# EasyEDA Pro project Armor_ProProject.epro, schematic Schematic1
Create Date: 2023-03-07; Page Name: P1; Project Name: LED; Schematic Name: Schematic1; Update Date: 2023-03-07; Company: 嘉立创EDA; Page Size: A4; Version: V1.0
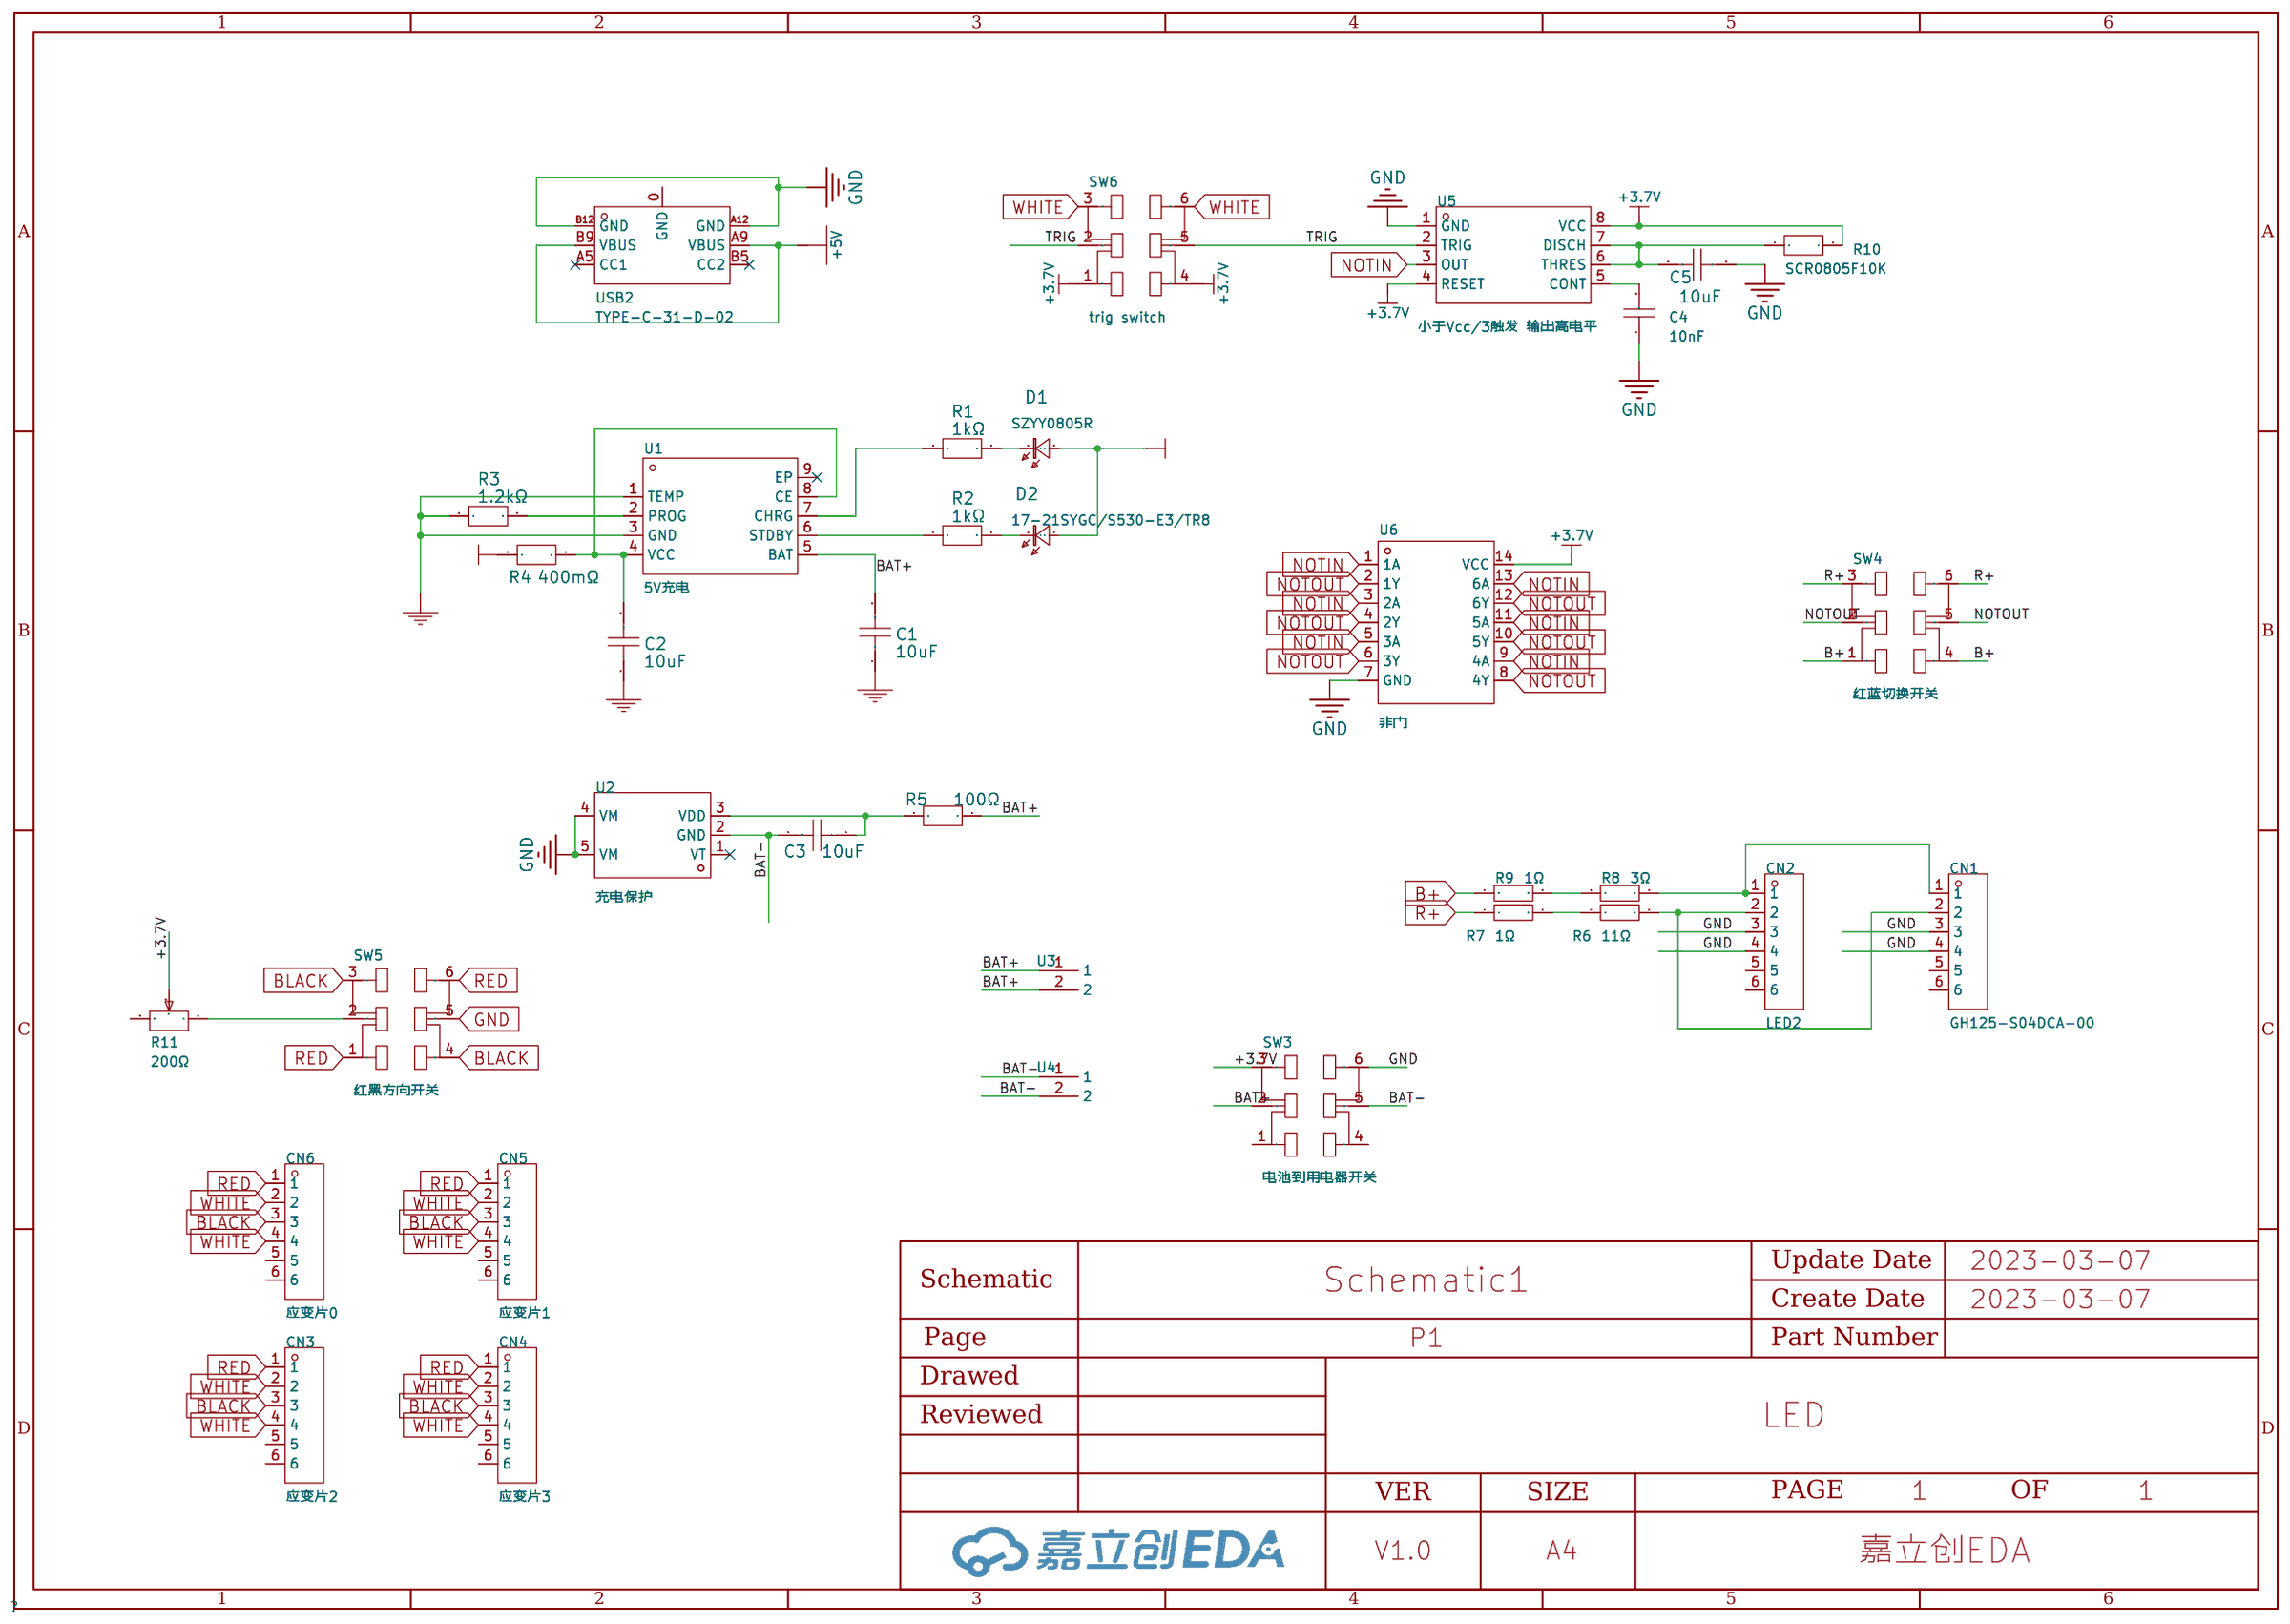
[diagram p8: schematic sheet]

## Parts
C1  10uF  [C0805]
C2  10uF  [C0805]
C3  10uF  [C0805]
C4  10nF  [C0805]
C5  10uF  [C0805]
CN1  GH125-S04DCA-00  [CONN-SMD_4P-P1.27_GH125-S04DCA-00]
CN2  LED2  [CONN-SMD_4P-P1.27_GH125-S04DCA-00]
CN3  应变片2  [CONN-SMD_4P-P1.27_GH125-S04DCA-00]
CN4  应变片3  [CONN-SMD_4P-P1.27_GH125-S04DCA-00]
CN5  应变片1  [CONN-SMD_4P-P1.27_GH125-S04DCA-00]
CN6  应变片0  [CONN-SMD_4P-P1.27_GH125-S04DCA-00]
D1  SZYY0805R  [LED0805-R-RD]
D2  17-21SYGC/S530-E3/TR8  [LED0805-RD]
R1  1kΩ  [R0805]
R2  1kΩ  [R0805]
R3  1.2kΩ  [R0805]
R4  400mΩ  [R0805]
R5  100Ω  [R1206]
R6  11Ω  [R1206]
R7  1Ω  [R1206]
R8  3Ω  [R1206]
R9  1Ω  [R1206]
R10  SCR0805F10K  [R0805]
R11  200Ω  [RES-ADJ-TH_3296W]
SW3  电池到用电器开关  [SW-TH_MSS22D18GX]
SW4  红蓝切换开关  [SW-TH_MSS22D18GX]
SW5  红黑方向开关  [SW-TH_MSS22D18GX]
SW6  trig switch  [SW-TH_MSS22D18GX]
U1  5V充电  [ESOP-8_L4.9-W3.9-P1.27-LS6.0-BL-EP]
U2  充电保护  [SOT-23-5_L3.0-W1.7-P0.95-LS2.8-BR]
U3  -  [2p]
U4  -  [2p]
U5  小于Vcc/3触发 输出高电平  [SOP-8_L5.0-W4.0-P1.27-LS6.0-BL]
U6  非门  [SOIC-14_L8.7-W3.9-P1.27-LS6.0-BL]
USB2  TYPE-C-31-D-02  [USB-C-SMD_TYPE-C-31-D-02]

## Library data of the parts
C1-C3 C5 = CL21A106KBYQNNE: 容值:10uF;精度:±10%;额定电压:50V;材质(温度系数):X5R;; LCSC Part Name: 10uF ±10% 50V; Supplier Part: C2932476; Manufacturer: SAMSUNG(三星); Supplier Footprint: 0805; JLCPCB Part Class: Extended Part; Datasheet: https://atta.szlcsc.com/upload/public/pdf/source/20211217/EA547804C3DC63CB0E92325AB8B6CF61.pdf; Supplier: LCSC; Tolerance: ±10%; Voltage Rated: 50V; Temperature Coefficient: X5R
C4 = CL21B103KBANNNC: 容值:10nF;精度:±10%;额定电压:50V;材质(温度系数):X7R;; LCSC Part Name: 10nF ±10% 50V; Supplier Part: C1710; Manufacturer: SAMSUNG(三星); Supplier Footprint: 0805; JLCPCB Part Class: Basic Part; Datasheet: https://atta.szlcsc.com/upload/public/pdf/source/20160103/1457707693082.pdf; Supplier: LCSC; Tolerance: ±10%; Voltage Rated: 50V; Temperature Coefficient: X7R
CN1-CN6 = GH125-S04DCA-00: 参考系列:-;间距:1.25mm;插针结构:1x4P;排数:1;每排PIN数:4;行距:-;公母:公型插针;安装方式:卧贴;额定电流:1A;工作温度范围:-25℃~+85℃;; LCSC Part Name: GH1.25卧式贴片 带扣; Supplier Part: C2886767; Manufacturer: JS(钜硕电子); Supplier Footprint: SMD,P=1.25mm; JLCPCB Part Class: Extended Part; Datasheet: https://atta.szlcsc.com/upload/public/pdf/source/20210818/CD11791E5ED3EDF45A7009E9C8A2BD4C.pdf; Supplier: LCSC; Pitch: 1.25mm; Pins Structure: 1x4P; Number of Rows: 1; Number of PINs Per Row: 4; Gender: 公型插针; Mounting Style: 卧贴; Current Rating (Max): 1A; Operating Temperature Range: -25℃~+85℃
D1 = SZYY0805R: 发光颜色:红灯;二极管配置:-;透镜颜色:无色透明;主波长:615nm~630nm;峰值波长:645nm;色温:-;测试电流:10mA;功率:40mW;发光角度:120°;安装方式:-;工作温度:-40℃~+85℃;; LCSC Part Name: 红灯 615nm~630nm; Supplier Part: C434431; Manufacturer: yongyu(永裕光电); Supplier Footprint: 0805; JLCPCB Part Class: Extended Part; Datasheet: https://atta.szlcsc.com/upload/public/pdf/source/20191204/C434431_431C171B758FE4C37FA40B1B295AA7AB.pdf; Supplier: LCSC; Emitted Color: 红灯; Lens Color: 无色透明; Dominant Wavelength: 615nm~630nm; Peak Wavelength: 645nm; Forward Current: 10mA; Power Dissipation: 40mW; Viewing Angle: 120°; Operating Temperature: -40℃~+85℃
D2 = 17-21SYGC/S530-E3/TR8: 发光颜色:普绿/黄绿;; LCSC Part Name: 普绿/黄绿; Supplier Part: C142303; Manufacturer: EVERLIGHT(亿光); Supplier Footprint: 0805; JLCPCB Part Class: Extended Part; Datasheet: https://atta.szlcsc.com/upload/public/pdf/source/20171110/C142303_15102792667121104246.pdf; Supplier: LCSC; Emitted Color: 普绿/黄绿
R1 R2 = 0805W8F1001T5E: 电阻类型:厚膜电阻;阻值:1kΩ;精度:±1%;功率:125mW;温度系数:±100ppm/℃;最大工作电压:150V;工作温度范围:-55℃~+155℃;; LCSC Part Name: 1kΩ ±1% 125mW; Supplier Part: C17513; Manufacturer: UNI-ROYAL(厚声); Supplier Footprint: 0805; JLCPCB Part Class: Basic Part; Datasheet: https://atta.szlcsc.com/upload/public/pdf/source/20200306/C422600_1E6D84923E4A46A82E41ADD87F860B5C.pdf; Supplier: LCSC; Type: 厚膜电阻; Tolerance: ±1%; Power(Watts): 125mW; Temperature Coefficient: ±100ppm/℃; Overload Voltage (Max): 150V; Operating Temperature Range: -55℃~+155℃
R3 = ERA6AEB122V: 电阻类型:薄膜电阻;阻值:1.2kΩ;精度:±0.1%;功率:125mW;温度系数:±25ppm/℃;最大工作电压:100V;工作温度范围:-55℃~+155℃;; LCSC Part Name: 1.2kΩ ±0.1% 125mW; Supplier Part: C445651; Manufacturer: PANASONIC(松下); Supplier Footprint: 0805; JLCPCB Part Class: Extended Part; Supplier: LCSC; Type: 薄膜电阻; Tolerance: ±0.1%; Power(Watts): 125mW; Temperature Coefficient: ±25ppm/℃; Overload Voltage (Max): 100V; Operating Temperature Range: -55℃~+155℃
R4 = HP05W3F400LT5E: 阻值:400mΩ;精度:±1%;功率:333.333mW;温度系数:±100ppm/℃;最大工作电压:150V;工作温度范围:-55℃~+155℃;; LCSC Part Name: 400mΩ ±1% 333.333mW; Supplier Part: C414973; Manufacturer: UNI-ROYAL(厚声); Supplier Footprint: 0805; JLCPCB Part Class: Extended Part; Datasheet: https://atta.szlcsc.com/upload/public/pdf/source/20191008/C414973_0094DBD61372C1BECB80DFA379D560E2.pdf; Supplier: LCSC; Tolerance: ±1%; Power(Watts): 333.333mW; Temperature Coefficient: ±100ppm/℃; Overload Voltage (Max): 150V; Operating Temperature Range: -55℃~+155℃
R5 = RS-06K101JT: 功率:250mW;精度:±5%;温度系数:±100ppm/℃;阻值:100Ω;最大工作电压:200V;工作温度范围:-55℃~+155℃;; LCSC Part Name: 100Ω(101) ±5%; Supplier Part: C118845; Manufacturer: FH(风华); Supplier Footprint: 1206; JLCPCB Part Class: Extended Part; Datasheet: https://atta.szlcsc.com/upload/public/pdf/source/20170713/C118845_1499918910036816811.pdf; Supplier: LCSC; Power(Watts): 250mW; Tolerance: ±5%; Temperature Coefficient: ±100ppm/℃; Overload Voltage (Max): 200V; Operating Temperature Range: -55℃~+155℃
R6 = AECR1206F11R0K9: 功率:0.25W;精度:±1%;阻值:11Ω;; LCSC Part Name: 11.0Ω(11R0) ±1%; Supplier Part: C352157; Manufacturer: RESI(开步睿思）; Supplier Footprint: 1206; JLCPCB Part Class: Extended Part; Datasheet: https://atta.szlcsc.com/upload/public/pdf/source/20181212/C352157_5F9829AD9A08A3B34426EDFFEF7F38D3.pdf; Supplier: LCSC; Power(Watts): 0.25W; Tolerance: ±1%
R7 R9 = CRH1206F1R00P05Z: 电阻类型:厚膜电阻;阻值:1Ω;精度:±1%;功率:500mW;温度系数:±400ppm/℃;最大工作电压:200V;工作温度范围:-55℃~+155℃;; LCSC Part Name: 1Ω ±1% 500mW; Supplier Part: C149686; Manufacturer: EVER OHMS(天二科技); Supplier Footprint: 1206; JLCPCB Part Class: Extended Part; Datasheet: https://atta.szlcsc.com/upload/public/pdf/source/20190415/C149686_62EDC74ADBAA712146150AABD81B2BA2.pdf; Supplier: LCSC; Type: 厚膜电阻; Tolerance: ±1%; Power(Watts): 500mW; Temperature Coefficient: ±400ppm/℃; Overload Voltage (Max): 200V; Operating Temperature Range: -55℃~+155℃
R8 = RMC120631%N: 阻值:3Ω;精度:±1%;功率:250mW;; LCSC Part Name: 3Ω ±1% 250mW; Supplier Part: C269590; Manufacturer: Tyohm(幸亚电阻); Supplier Footprint: 1206; JLCPCB Part Class: Extended Part; Datasheet: https://atta.szlcsc.com/upload/public/pdf/source/20190115/C269590_73B87AFA0307F1D3F4DF79B04DB2EF08.pdf; Supplier: LCSC; Tolerance: ±1%; Power(Watts): 250mW
R10 = SCR0805F10K: Supplier Part: C3016734; Manufacturer: VO(翔胜); Supplier Footprint: 0805; JLCPCB Part Class: Extended Part; Datasheet: https://atta.szlcsc.com/upload/public/pdf/source/20220513/247AF9639BA21CF93567DC289CCC6A22.pdf; Supplier: LCSC
R11 = 3296W-1-201LF: 阻值:200Ω;精度:±10%;; LCSC Part Name: 200Ω ±10%; Supplier Part: C83685; Manufacturer: BOURNS; Supplier Footprint: 插件; JLCPCB Part Class: Extended Part; Datasheet: https://atta.szlcsc.com/upload/public/pdf/source/20160920/1474356682283.pdf; Supplier: LCSC; Tolerance: ±10%
SW3-SW6 = MSS22D18G2: 额定电流(DC)：100mA 额定电压(DC)：12V 电路结构：单刀双掷 安装方式：立插 机械寿命：10000 滑钮形状：矩形柱状 引脚样式：SMD接片 工作温度：-10℃~+50℃ 开关长度：9.1mm 开关宽度：3.5mm 开关高度：3.5mm 柄高：2mm; LCSC Part Name: 两档立式插件 6脚拨动 柄长2.0MM; Supplier Part: C431542; Manufacturer: SHOU HAN(首韩); Supplier Footprint: 插件-6P,3.5x9.1mm; JLCPCB Part Class: Extended Part; Datasheet: https://atta.szlcsc.com/upload/public/pdf/source/20190925/C431542_E050BEEB1B86229ABAC8A73C9D45E525.pdf; Supplier: LCSC
U1 = TP4056: 充电电池的类型:-;电池单元组数:-;最大充电电流:-;充满的电池组电压:-;最大供应电压:-;; Supplier Part: C725790; Manufacturer: UMW(友台半导体); Supplier Footprint: ESOP-8; JLCPCB Part Class: Extended Part; Datasheet: https://atta.szlcsc.com/upload/public/pdf/source/20211011/37515E71BA298E23D23475482C49633D.pdf; Supplier: LCSC
U2 = XB5352A: 充电电池的类型:-;电池单元组数:-;最大充电电流:-;充满的电池组电压:-;最大供应电压:-;; Supplier Part: C154943; Manufacturer: xysemi(赛芯微); Supplier Footprint: SOT-23-5; JLCPCB Part Class: Extended Part; Datasheet: https://atta.szlcsc.com/upload/public/pdf/source/20171201/C154943_15121109401661155500.pdf; Supplier: LCSC
U3 U4 = 2p
U5 = NE555DR: LCSC Part Name: 时基集成芯片; Supplier Part: C695838; Manufacturer: UMW(广东友台半导体); Supplier Footprint: SOP-8; JLCPCB Part Class: Extended Part; Datasheet: https://atta.szlcsc.com/upload/public/pdf/source/20200827/C695838_9FAFB35032B65D2B8574401BDF236263.pdf; Supplier: LCSC
U6 = 74HC14D,653: Supplier Part: C5605; Manufacturer: Nexperia(安世); Supplier Footprint: SOIC-14-150mil; JLCPCB Part Class: Basic Part; Datasheet: https://atta.szlcsc.com/upload/public/pdf/source/20170209/1486607341486.pdf; Supplier: LCSC
USB2 = TYPE-C-31-D-02: LCSC Part Name: 立式TYPE-C; Supplier Part: C707317; Manufacturer: 韩国韩荣; JLCPCB Part Class: Extended Part; Datasheet: https://atta.szlcsc.com/upload/public/pdf/source/20200721/C707317_DD92A8411CE7F6B9DE873484D469419F.pdf; Supplier: LCSC

## Nets
+3.7V: R10.2 R11.2 SW3.3 SW6.1 SW6.4 U5.4(RESET) U5.8(VCC) U6.14(VCC)
+5V: D1.1(A) D2.1(A) R4.1 USB2.A9(VBUS) USB2.B9(VBUS)
GND: C1.1 C2.1 C4.1 C5.1 CN1.3 CN1.4 CN2.3 CN2.4 R3.1 SW3.6 SW5.5 U1.1(TEMP) U1.3(GND) U2.4(VM) U2.5(VM) U5.1(GND) U6.7(GND) USB2.A12(GND) USB2.B12(GND)
B+: R9.1 SW4.1 SW4.4
BAT+: C1.2 R5.2 SW3.2 U1.5(BAT) U3.1 U3.2
BAT-: C3.2 SW3.5 U2.2(GND) U4.1 U4.2
BLACK: CN3.3 CN4.3 CN5.3 CN6.3 SW5.3 SW5.4
NOTIN: U5.3(OUT) U6.1(1A) U6.3(2A) U6.5(3A) U6.9(4A) U6.11(5A) U6.13(6A)
NOTOUT: SW4.2 SW4.5 U6.2(1Y) U6.4(2Y) U6.6(3Y) U6.8(4Y) U6.10(5Y) U6.12(6Y)
R+: R7.1 SW4.3 SW4.6
RED: CN3.1 CN4.1 CN5.1 CN6.1 SW5.1 SW5.6
TRIG: SW6.2 SW6.5 U5.2(TRIG)
WHITE: CN3.2 CN3.4 CN4.2 CN4.4 CN5.2 CN5.4 CN6.2 CN6.4 SW6.3 SW6.6
$1N495: R1.1 U1.7(CHRG)
$1N496: R2.1 U1.6(STDBY)
$1N498: R3.2 U1.2(PROG)
$1N510: C3.1 R5.1 U2.3(VDD)
$1N514: D1.2(K) R1.2
$1N515: D2.2(K) R2.2
$1N6240: R6.1 R7.2
$1N6342: CN1.1 CN2.1 R8.2
$1N6347: R8.1 R9.2
$1N7624: CN1.2 CN2.2 R6.2
$1N8360: C2.2 R4.2 U1.4(VCC) U1.8(CE)
$1N8565: C4.2 U5.5(CONT)
$1N8693: C5.2 R10.1 U5.6(THRES) U5.7(DISCH)
$1N10046: R11.1 SW5.2

Not connected (* = marked no-connect by the designer): CN1 5 6; CN2 5 6; CN3 5 6; CN4 5 6; CN5 5 6; CN6 5 6; R11 3; SW3 1 4; U1 9(EP)*; U2 1(VT)*; USB2 0(GND) A5(CC1)* B5(CC2)*
